# EAGLE schematic x-at-arduino (EAGLE 7.2.0)
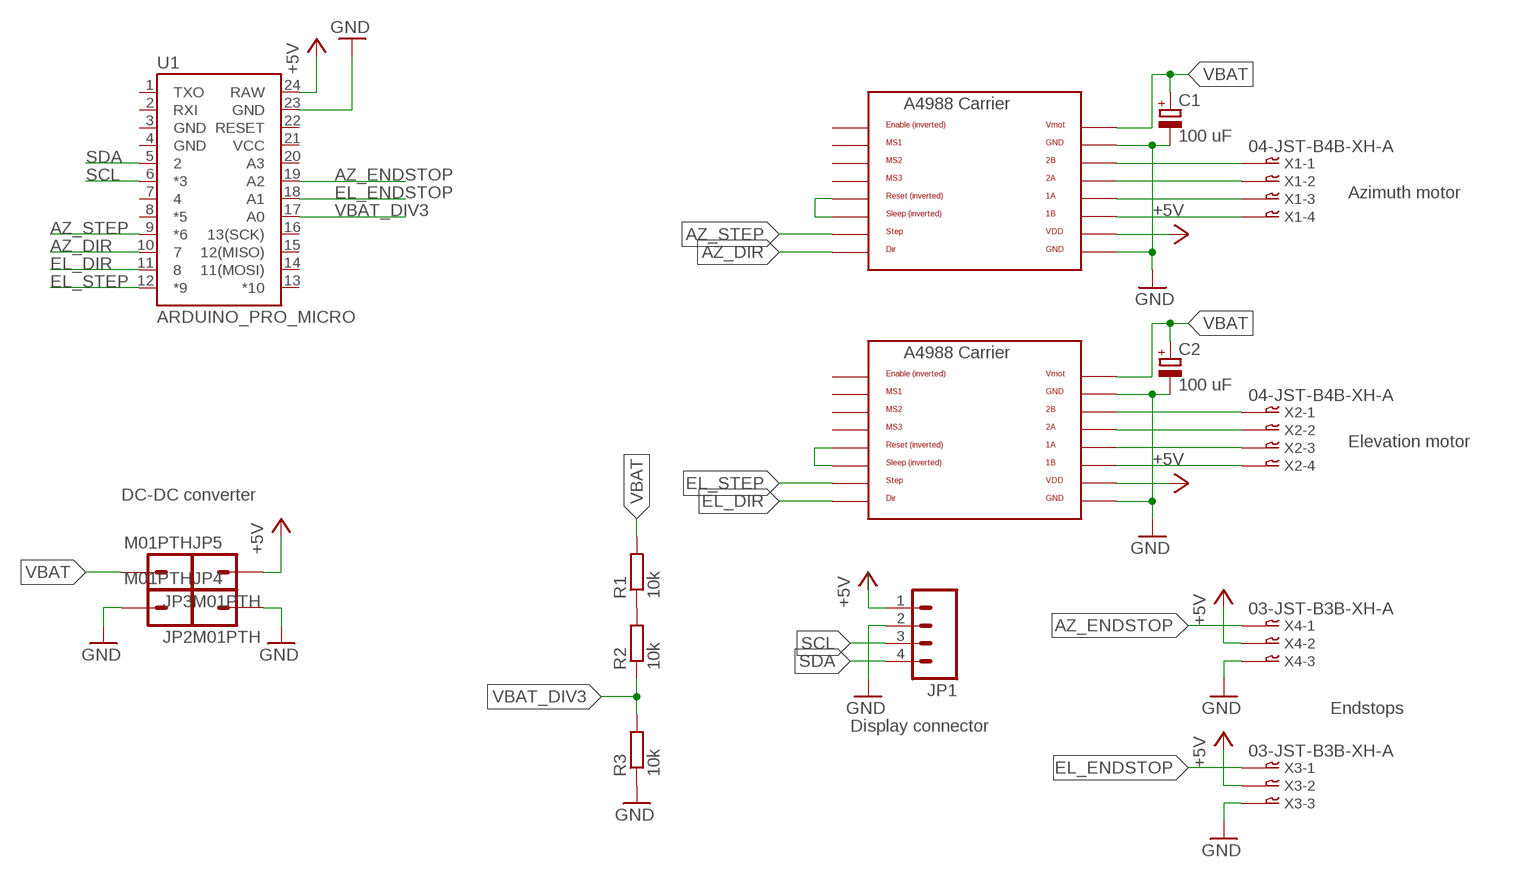
[diagram p0: schematic, sheet 1]

## Parts
C1  100 uF  CPOL-EUE5-6  [E5-6]
C2  100 uF  CPOL-EUE5-6  [E5-6]
JP1  M04PTH  [1X04]
JP2  M01PTH  [1X01]
JP3  M01PTH  [1X01]
JP4  M01PTH  [1X01]
JP5  M01PTH  [1X01]
R1  10k  R-EU_R0603  [R0603]
R2  10k  R-EU_R0603  [R0603]
R3  10k  R-EU_R0603  [R0603]
U1  ARDUINO_PRO_MICRO  [ARDUINO_PRO_MICRO]
U2  POLOLU_A4983CARRIER  [A4988BREAKOUT]
U3  POLOLU_A4983CARRIER  [A4988BREAKOUT]
X1  04-JST-B4B-XH-A  [B4B-XH]
X2  04-JST-B4B-XH-A  [B4B-XH]
X3  03-JST-B3B-XH-A  [B3B-XH]
X4  03-JST-B3B-XH-A  [B3B-XH]

## Nets
+5V: JP1.1 JP5.1 U1.24(RAW) U2.VDD U3.VDD X3.P$2 X4.P$2
AZ_DIR: U1.10 U2.DIR
AZ_ENDSTOP: U1.19(A2) X4.P$1
AZ_STEP: U1.9(*6) U2.STEP
EL_DIR: U1.11 U3.DIR
EL_ENDSTOP: U1.18(A1) X3.P$1
EL_STEP: U1.12(*9) U3.STEP
GND: C1.- C2.- JP1.2 JP2.1 JP4.1 R3.1 U1.23(GND) U2.GND U2.GND@0(GND) U3.GND U3.GND@0(GND) X3.P$3 X4.P$3
N$1: U2.2B X1.P$1
N$2: U2.2A X1.P$2
N$3: U2.1A X1.P$3
N$4: U2.1B X1.P$4
N$5: U3.2B X2.P$1
N$6: U3.2A X2.P$2
N$7: U3.1A X2.P$3
N$8: U3.1B X2.P$4
N$9: R1.1 R2.2
N$10: U3.RST U3.SLP(SLEEP)
N$11: U2.RST U2.SLP(SLEEP)
SCL: JP1.3 U1.6(*3)
SDA: JP1.4 U1.5
VBAT: C1.+ C2.+ JP3.1 R1.2 U2.VMOT U3.VMOT
VBAT_DIV3: R2.1 R3.2 U1.17(A0)
Unconnected: U1.1(TXO) U1.2(RXI) U1.3(GND) U1.4(GND) U1.7 U1.8(*5) U1.13(*10) U1.14(11(MOSI)) U1.15(12(MISO)) U1.16(13(SCK)) U1.20(A3) U1.21(VCC) U1.22(RESET) U2.EN U2.MS1 U2.MS2 U2.MS3 U3.EN U3.MS1 U3.MS2 U3.MS3

## Notes on the sheet
- Azimuth motor
- Elevation motor
- DC-DC converter
- Endstops
- Display connector

## Library data of the parts
C1 C2 = rcl:CPOL-EU: POLARIZED CAPACITOR, European symbol
JP1 = SparkFun-Connectors:M04: Header 4 Standard 4-pin 0.1" header. Use with straight break away headers (SKU : PRT-00116), right angle break away headers (PRT-00553), swiss pins (PRT-00743), machine pins (PRT-00117), and female headers (PRT-00115). Molex polarized connector foot print use with SKU : PRT-08231 with associated crimp pins and housings. 1MM SMD Version SKU: PRT-10208
JP2-JP5 = SparkFun-Connectors:M01: Header 1 Standard 1-pin 0.1" header. Use with straight break away headers (SKU : PRT-00116), right angle break away headers (PRT-00553), swiss pins (PRT-00743), machine pins (PRT-00117), and female headers (PRT-00115).
R1-R3 = rcl:R-EU_: RESISTOR, European symbol
U1 = SparkFun-Boards:ARDUINO_PRO_MICRO
U2 U3 = RepRapjr:POLOLU_A4983CARRIER
X1 X2 = bt_con-jst-xh:04-JST: JST CONNECTOR
X3 X4 = bt_con-jst-xh:03-JST: JST CONNECTOR